# EAGLE schematic extension_board_interface (EAGLE 7.1.0)
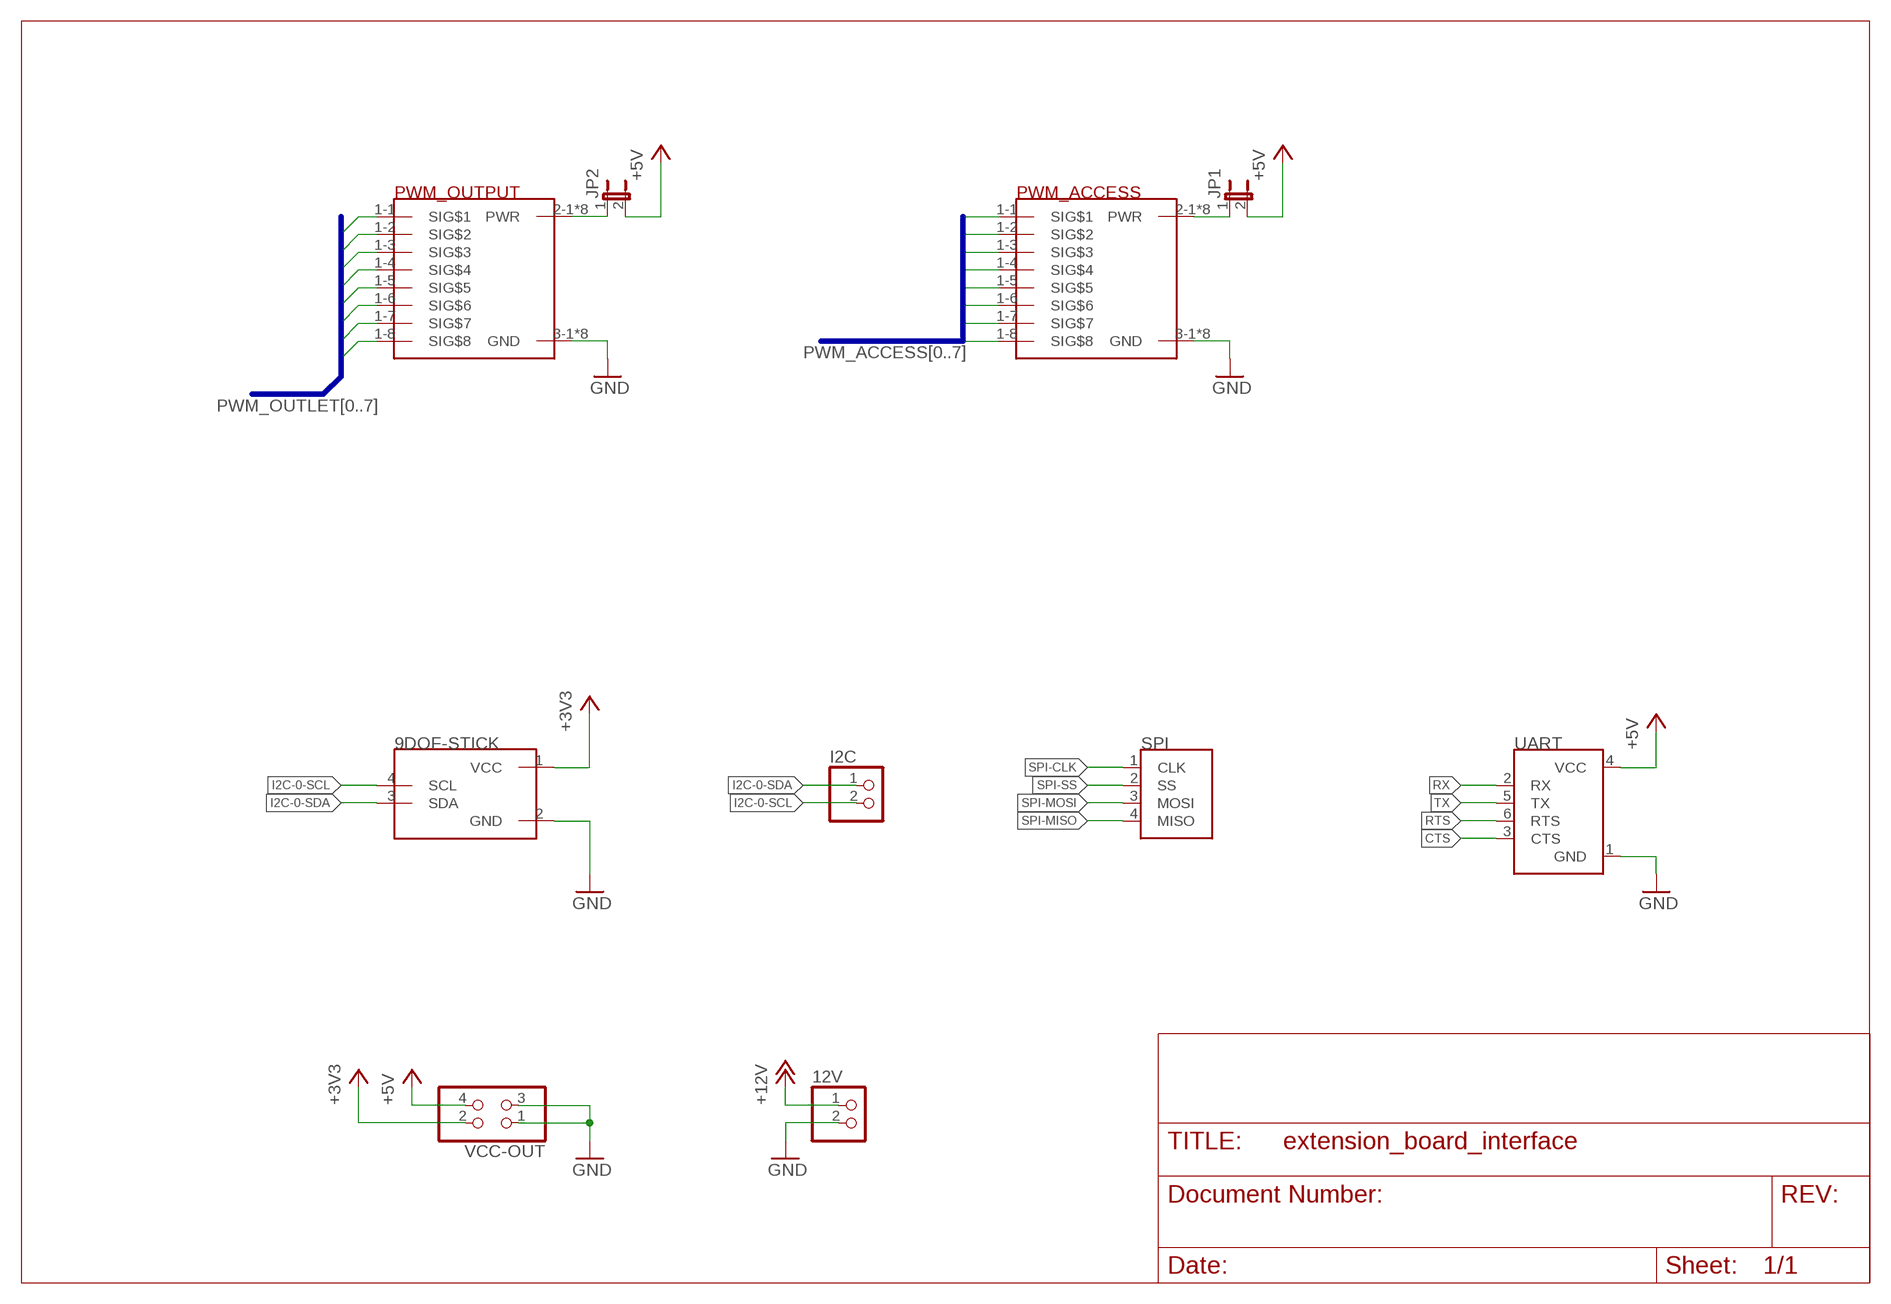
[diagram p0: schematic, sheet 1]

## Parts
9DOF-STICK  I2C  [MA04-1]
12V  PINHD-1X2  [1X02]
I2C  PINHD-1X2  [1X02]
JP1  JP1E  [JP1]
JP2  JP1E  [JP1]
PWM_ACCESS  8RX  [MA08-3]
PWM_OUTPUT  8RX  [MA08-3]
SPI  SPI  [MA04-1]
UART  UART  [MA03-2]
VCC-OUT  PINHD-2X2  [2X02]

## Nets
+3V3: 9DOF-STICK.1(VCC) VCC-OUT.2
+5V: JP1.2 JP2.2 UART.4(VCC) VCC-OUT.4
+12V: 12V.1
CTS: UART.3(CTS)
GND: 9DOF-STICK.2(GND) 12V.2 PWM_ACCESS.3-1(GND) PWM_ACCESS.3-2(GND) PWM_ACCESS.3-3(GND) PWM_ACCESS.3-4(GND) PWM_ACCESS.3-5(GND) PWM_ACCESS.3-6(GND) PWM_ACCESS.3-7(GND) PWM_ACCESS.3-8(GND) PWM_OUTPUT.3-1(GND) PWM_OUTPUT.3-2(GND) PWM_OUTPUT.3-3(GND) PWM_OUTPUT.3-4(GND) PWM_OUTPUT.3-5(GND) PWM_OUTPUT.3-6(GND) PWM_OUTPUT.3-7(GND) PWM_OUTPUT.3-8(GND) UART.1(GND) VCC-OUT.1 VCC-OUT.3
I2C-0-SCL: 9DOF-STICK.4(SCL) I2C.2
I2C-0-SDA: 9DOF-STICK.3(SDA) I2C.1
N$1: JP1.1 PWM_ACCESS.2-1(PWR) PWM_ACCESS.2-2(PWR) PWM_ACCESS.2-3(PWR) PWM_ACCESS.2-4(PWR) PWM_ACCESS.2-5(PWR) PWM_ACCESS.2-6(PWR) PWM_ACCESS.2-7(PWR) PWM_ACCESS.2-8(PWR)
N$2: JP2.1 PWM_OUTPUT.2-1(PWR) PWM_OUTPUT.2-2(PWR) PWM_OUTPUT.2-3(PWR) PWM_OUTPUT.2-4(PWR) PWM_OUTPUT.2-5(PWR) PWM_OUTPUT.2-6(PWR) PWM_OUTPUT.2-7(PWR) PWM_OUTPUT.2-8(PWR)
PWM_ACCESS0: PWM_ACCESS.1-1(SIG$1)
PWM_ACCESS1: PWM_ACCESS.1-2(SIG$2)
PWM_ACCESS2: PWM_ACCESS.1-3(SIG$3)
PWM_ACCESS3: PWM_ACCESS.1-4(SIG$4)
PWM_ACCESS4: PWM_ACCESS.1-5(SIG$5)
PWM_ACCESS5: PWM_ACCESS.1-6(SIG$6)
PWM_ACCESS6: PWM_ACCESS.1-7(SIG$7)
PWM_ACCESS7: PWM_ACCESS.1-8(SIG$8)
PWM_OUTLET0: PWM_OUTPUT.1-1(SIG$1)
PWM_OUTLET1: PWM_OUTPUT.1-2(SIG$2)
PWM_OUTLET2: PWM_OUTPUT.1-3(SIG$3)
PWM_OUTLET3: PWM_OUTPUT.1-4(SIG$4)
PWM_OUTLET4: PWM_OUTPUT.1-5(SIG$5)
PWM_OUTLET5: PWM_OUTPUT.1-6(SIG$6)
PWM_OUTLET6: PWM_OUTPUT.1-7(SIG$7)
PWM_OUTLET7: PWM_OUTPUT.1-8(SIG$8)
RTS: UART.6(RTS)
RX: UART.2(RX)
SPI-CLK: SPI.1(CLK)
SPI-MISO: SPI.4(MISO)
SPI-MOSI: SPI.3(MOSI)
SPI-SS: SPI.2(SS)
TX: UART.5(TX)

## Buses
PWM_ACCESS[0..7]
PWM_OUTLET[0..7]

## Library data of the parts
9DOF-STICK = multicopter:I2C
12V I2C = pinhead:PINHD-1X2: PIN HEADER
JP1 JP2 = jumper:JP1E: JUMPER
PWM_ACCESS PWM_OUTPUT = multicopter:8RX
SPI = multicopter:SPI
UART = multicopter:UART
VCC-OUT = pinhead:PINHD-2X2: PIN HEADER